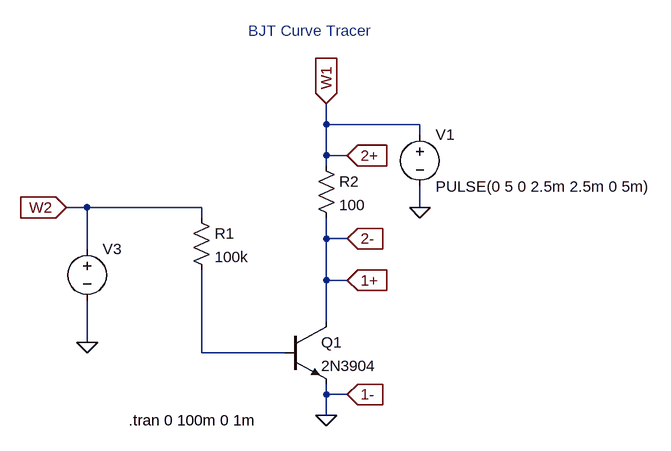
[diagram p0: schematic bjt_curve.asc]
bjt_curve.asc, the LTspice schematic file:
Version 4
SHEET 1 1908 756
WIRE 432 -96 432 -128
WIRE 576 -96 432 -96
WIRE 576 -80 576 -96
WIRE 432 -48 432 -96
WIRE 464 -48 432 -48
WIRE 432 -32 432 -48
WIRE 64 32 32 32
WIRE 240 32 64 32
WIRE 576 32 576 0
WIRE 240 48 240 32
WIRE 432 80 432 48
WIRE 464 80 432 80
WIRE 64 96 64 32
WIRE 432 144 432 80
WIRE 464 144 432 144
WIRE 432 208 432 144
WIRE 64 240 64 176
WIRE 240 256 240 128
WIRE 368 256 240 256
WIRE 432 320 432 304
WIRE 464 320 432 320
WIRE 432 352 432 320
FLAG 64 240 0
FLAG 432 352 0
FLAG 576 32 0
FLAG 432 -128 W1
IOPIN 432 -128 In
FLAG 32 32 W2
IOPIN 32 32 In
FLAG 464 -48 2+
IOPIN 464 -48 In
FLAG 464 80 2-
IOPIN 464 80 In
FLAG 464 144 1+
IOPIN 464 144 In
FLAG 464 320 1-
IOPIN 464 320 In
SYMBOL res 224 32 R0
SYMATTR InstName R1
SYMATTR Value 100k
SYMBOL npn 368 208 R0
SYMATTR InstName Q1
SYMATTR Value 2N3904
SYMBOL res 416 -48 R0
SYMATTR InstName R2
SYMATTR Value 100
SYMBOL voltage 576 -96 R0
WINDOW 123 0 0 Left 0
WINDOW 39 0 0 Left 0
SYMATTR InstName V1
SYMATTR Value PULSE(0 5 0 2.5m 2.5m 0 5m)
SYMBOL voltage 64 80 R0
WINDOW 3 24 44 Invisible 2
SYMATTR Value PWL REPEAT FOREVER (5m 0.6 5.00000001m 1.6 10m 1.6 10.0000001m 2.6 15m 2.6 15.000001m 3.6 20m 3.6 20.00001m 4.6 25m 4.6 25.0000001m 0.6) ENDREPEAT
SYMATTR InstName V3
TEXT 128 360 Left 2 !.tran 0 100m 0 1m
TEXT 312 -240 Left 2 ;BJT Curve Tracer

The netlist it stands for:
* bjt_curve.asc
R1 W2 N001 100k
Q1 1+ N001 0 0 2N3904
R2 2+ 1+ 100
V1 2+ 0 PULSE(0 5 0 2.5m 2.5m 0 5m)
V3 W2 0 PWL REPEAT FOREVER (5m 0.6 5.00000001m 1.6 10m 1.6 10.0000001m 2.6 15m 2.6 15.000001m 3.6 20m 3.6 20.00001m 4.6 25m 4.6 25.0000001m 0.6) ENDREPEAT
.model NPN NPN
.model PNP PNP
.lib standard.bjt
.tran 0 100m 0 1m
* BJT Curve Tracer
.backanno
.end